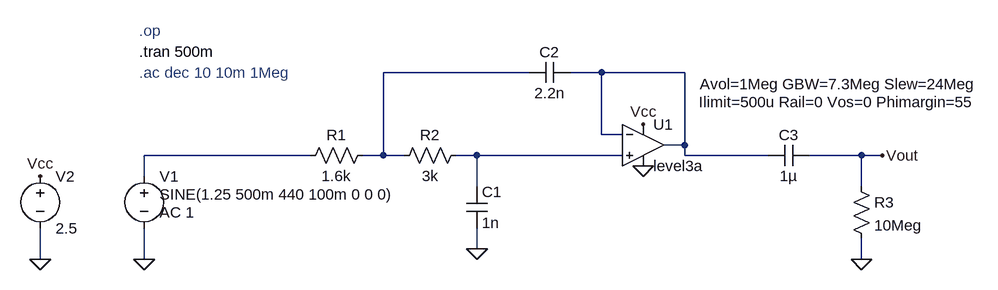
[diagram p0: schematic output_lpf.asc]
output_lpf.asc, the LTspice schematic file:
Version 4
SHEET 1 1260 680
WIRE 496 -48 272 -48
WIRE 608 -48 560 -48
WIRE 736 -48 608 -48
WIRE 608 48 608 -48
WIRE 640 48 608 48
WIRE 736 64 736 -48
WIRE 736 64 704 64
WIRE 160 80 -96 80
WIRE 272 80 272 -48
WIRE 272 80 240 80
WIRE 304 80 272 80
WIRE 416 80 384 80
WIRE 640 80 416 80
WIRE 736 80 736 64
WIRE 864 80 736 80
WIRE 1008 80 928 80
WIRE 1040 80 1008 80
WIRE -96 112 -96 80
WIRE 416 128 416 80
WIRE 1008 128 1008 80
WIRE 416 224 416 192
WIRE -256 240 -256 192
WIRE -96 240 -96 192
WIRE 1008 240 1008 208
FLAG 416 224 0
FLAG -96 240 0
FLAG 1008 240 0
FLAG -256 240 0
FLAG -256 112 Vcc
FLAG 672 32 Vcc
FLAG 672 96 0
FLAG 1040 80 Vout
SYMBOL voltage -96 96 R0
WINDOW 3 24 44 Left 2
WINDOW 123 24 72 Left 2
WINDOW 39 0 0 Left 0
SYMATTR Value SINE(1.25 500m 440 100m 0 0 0)
SYMATTR Value2 AC 1
SYMATTR InstName V1
SYMBOL res 256 64 R90
WINDOW 0 0 56 VBottom 2
WINDOW 3 32 56 VTop 2
SYMATTR InstName R1
SYMATTR Value 1.6k
SYMBOL res 400 64 R90
WINDOW 0 0 56 VBottom 2
WINDOW 3 32 56 VTop 2
SYMATTR InstName R2
SYMATTR Value 3k
SYMBOL cap 400 128 R0
SYMATTR InstName C1
SYMATTR Value 1n
SYMBOL cap 560 -64 R90
WINDOW 0 0 32 VBottom 2
WINDOW 3 32 32 VTop 2
SYMATTR InstName C2
SYMATTR Value 2.2n
SYMBOL res 992 112 R0
SYMATTR InstName R3
SYMATTR Value 10Meg
SYMBOL OpAmps\\UniversalOpAmp3 672 64 R0
WINDOW 123 87 -94 Left 2
WINDOW 39 86 -66 Left 2
WINDOW 40 86 -39 Left 2
SYMATTR Value2 Avol=1Meg GBW=7.3Meg Slew=24Meg
SYMATTR SpiceLine Ilimit=500u Rail=0 Vos=0 Phimargin=55
SYMATTR InstName U1
SYMBOL voltage -256 96 R0
WINDOW 123 0 0 Left 0
WINDOW 39 0 0 Left 0
SYMATTR InstName V2
SYMATTR Value 2.5
SYMBOL cap 928 64 R90
WINDOW 0 0 32 VBottom 2
WINDOW 3 32 32 VTop 2
SYMATTR InstName C3
SYMATTR Value 1µ
TEXT -104 -48 Left 2 ;.ac dec 10 10m 1Meg
TEXT -104 -112 Left 2 ;.op
TEXT -104 -80 Left 2 !.tran 500m

The netlist it stands for:
* output_lpf.asc
V1 N003 0 SINE(1.25 500m 440 100m 0 0 0) AC 1
R1 N001 N003 1.6k
R2 N004 N001 3k
C1 N004 0 1n
C2 N002 N001 2.2n
R3 Vout 0 10Meg
XU1 N004 N002 Vcc 0 N002 level3a Avol=1Meg GBW=7.3Meg Slew=24Meg Ilimit=500u Rail=0 Vos=0 Phimargin=55  ; pins In+ In- V+ V- OUT
V2 Vcc 0 2.5
C3 Vout N002 1µ
* .ac dec 10 10m 1Meg
* .op
.tran 500m
.backanno
.end